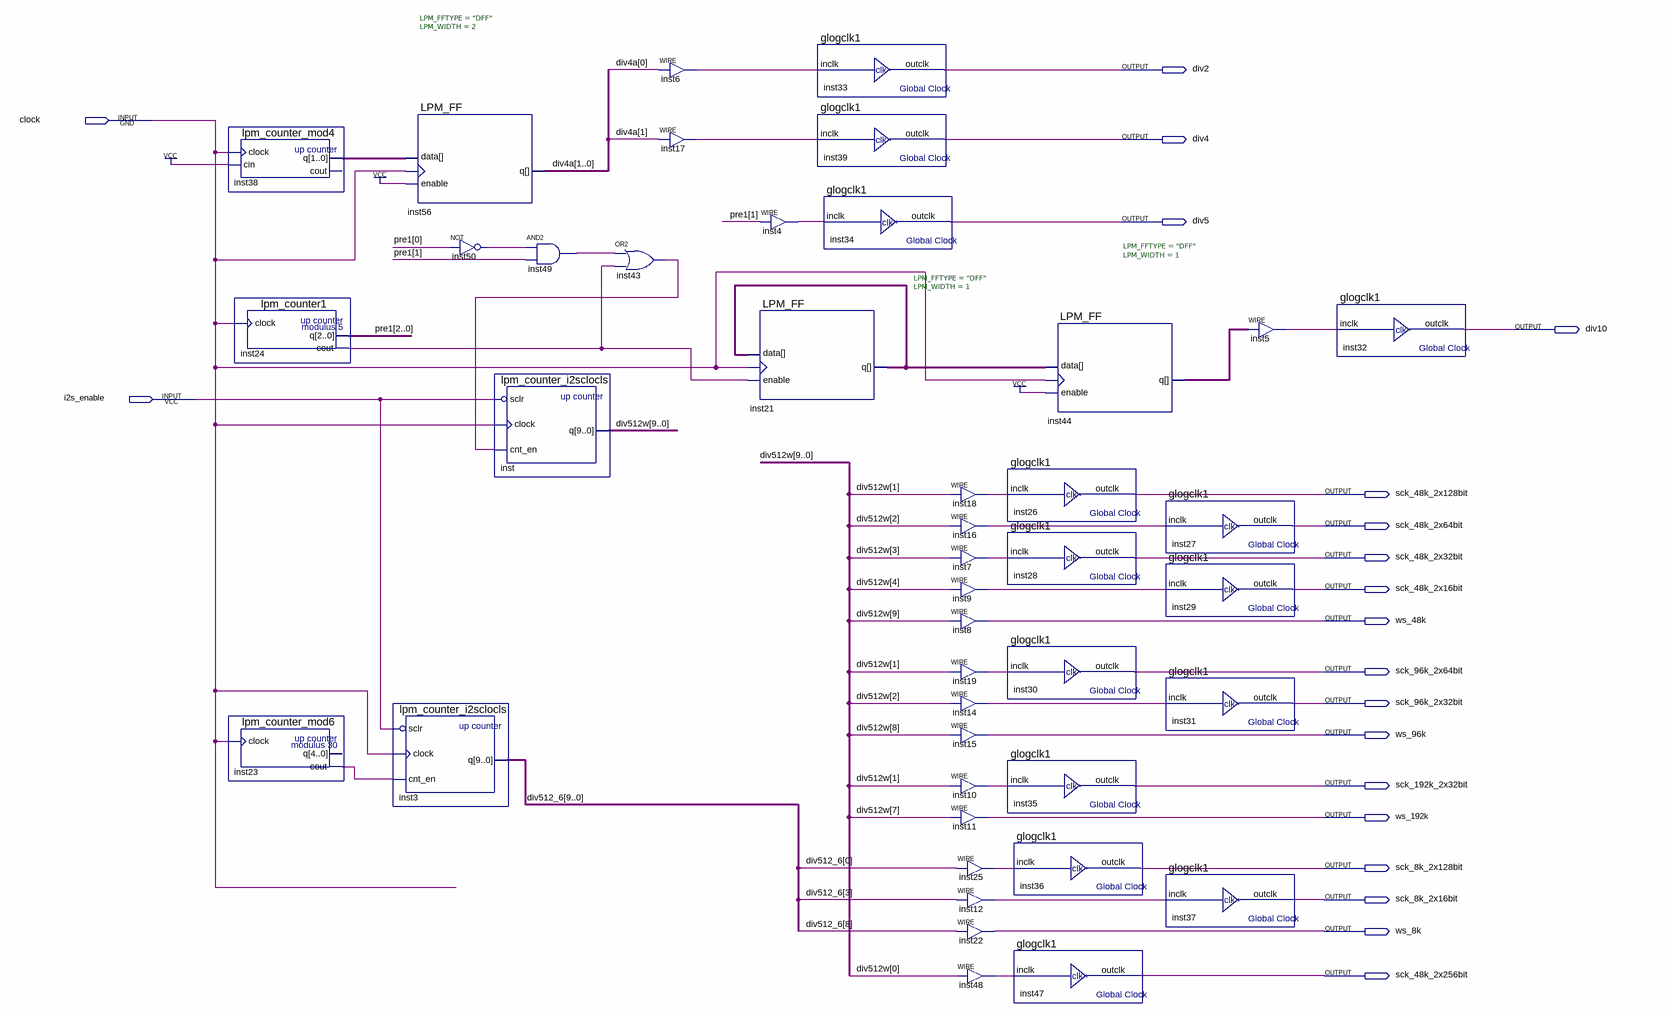
[diagram p0: schematic sheet]
// Quartus schematic i2smclk.bdf as structural Verilog: 43 symbols, 20 pins
module i2smclk (
  input  clock,
  input  i2s_enable,
  output div2,
  output div4,
  output div5,
  output div10,
  output sck_48k_2x128bit,
  output sck_48k_2x64bit,
  output sck_48k_2x32bit,
  output sck_48k_2x16bit,
  output ws_48k,
  output sck_96k_2x64bit,
  output sck_96k_2x32bit,
  output ws_96k,
  output sck_192k_2x32bit,
  output ws_192k,
  output sck_8k_2x128bit,
  output sck_8k_2x16bit,
  output ws_8k,
  output sck_48k_2x256bit
);

  wire inst4_out, inst5_out, inst6_out, inst7_out, inst9_out, inst10_out, inst12_out, inst14_out, inst16_out,
       inst17_out, inst18_out, inst19_out, inst21_q, inst23_cout, inst24_cout, inst25_out, inst43_out,
       inst44_q, inst48_out, inst49_out, inst50_out;
  wire [1:0] div4a, inst38_q;
  wire [2:0] pre1;
  wire [9:0] div512_6, div512w;

  lpm_counter_mod4 inst38 (.clock(clock), .cin(1'b1), .q(inst38_q));  // open: cout
  lpm_counter1 inst24 (.clock(clock), .cout(inst24_cout), .q(pre1));
  lpm_counter_mod6 inst23 (.clock(clock), .cout(inst23_cout));  // open: q
  lpm_counter_i2sclocls inst3 (.sclr(~i2s_enable), .clock(clock), .cnt_en(inst23_cout), .q(div512_6));
  LPM_FF #(.LPM_FFTYPE("DFF"), .LPM_WIDTH(2)) inst56 (.enable(1'b1), .clock(clock), .data(inst38_q), .q(div4a));
  not inst50 (inst50_out, pre1[0]);
  lpm_counter_i2sclocls inst (.sclr(~i2s_enable), .clock(clock), .cnt_en(inst43_out), .q(div512w));
  and inst49 (inst49_out, inst50_out, pre1[1]);
  or inst43 (inst43_out, inst49_out, inst24_cout);
  assign inst6_out = div4a[0];  // WIRE inst6
  assign inst17_out = div4a[1];  // WIRE inst17
  LPM_FF #(.LPM_FFTYPE("DFF"), .LPM_WIDTH(1)) inst21 (
    .enable(inst24_cout), .clock(clock), .data(inst21_q), .q(inst21_q));
  assign inst4_out = pre1[1];  // WIRE inst4
  glogclk1 inst33 (.inclk(inst6_out), .outclk(div2));
  glogclk1 inst39 (.inclk(inst17_out), .outclk(div4));
  glogclk1 inst34 (.inclk(inst4_out), .outclk(div5));
  assign inst18_out = div512w[1];  // WIRE inst18
  assign inst16_out = div512w[2];  // WIRE inst16
  assign inst7_out = div512w[3];  // WIRE inst7
  assign inst9_out = div512w[4];  // WIRE inst9
  assign ws_48k = div512w[9];  // WIRE inst8
  assign inst19_out = div512w[1];  // WIRE inst19
  assign inst14_out = div512w[2];  // WIRE inst14
  assign ws_96k = div512w[8];  // WIRE inst15
  assign inst10_out = div512w[1];  // WIRE inst10
  assign ws_192k = div512w[7];  // WIRE inst11
  assign inst25_out = div512_6[0];  // WIRE inst25
  assign inst12_out = div512_6[3];  // WIRE inst12
  assign ws_8k = div512_6[8];  // WIRE inst22
  assign inst48_out = div512w[0];  // WIRE inst48
  LPM_FF #(.LPM_FFTYPE("DFF"), .LPM_WIDTH(1)) inst44 (.enable(1'b1), .clock(clock), .data(inst21_q), .q(inst44_q));
  glogclk1 inst26 (.inclk(inst18_out), .outclk(sck_48k_2x128bit));
  glogclk1 inst28 (.inclk(inst7_out), .outclk(sck_48k_2x32bit));
  glogclk1 inst30 (.inclk(inst19_out), .outclk(sck_96k_2x64bit));
  glogclk1 inst35 (.inclk(inst10_out), .outclk(sck_192k_2x32bit));
  glogclk1 inst36 (.inclk(inst25_out), .outclk(sck_8k_2x128bit));
  glogclk1 inst47 (.inclk(inst48_out), .outclk(sck_48k_2x256bit));
  glogclk1 inst27 (.inclk(inst16_out), .outclk(sck_48k_2x64bit));
  glogclk1 inst29 (.inclk(inst9_out), .outclk(sck_48k_2x16bit));
  glogclk1 inst31 (.inclk(inst14_out), .outclk(sck_96k_2x32bit));
  glogclk1 inst37 (.inclk(inst12_out), .outclk(sck_8k_2x16bit));
  assign inst5_out = inst44_q;  // WIRE inst5
  glogclk1 inst32 (.inclk(inst5_out), .outclk(div10));
endmodule
